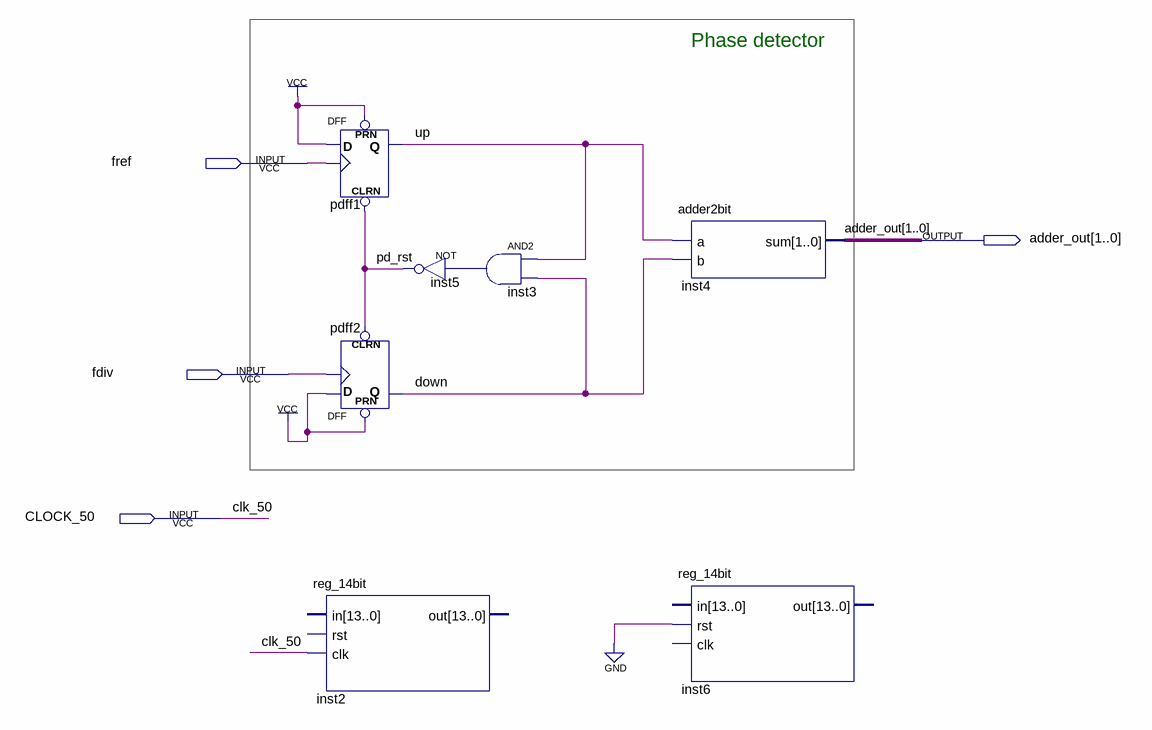
[diagram p0: schematic sheet]
// Quartus schematic Digital_async_PLL.bdf as structural Verilog: 7 symbols, 4 pins
module Digital_async_PLL (
  input  fref,
  input  fdiv,
  input  CLOCK_50,
  output [1:0] adder_out
);

  wire down, inst3_out, pd_rst, up;

  DFF pdff1 (.CLRN(pd_rst), .CLK(fref), .D(1'b1), .PRN(1'b1), .Q(up));
  DFF pdff2 (.CLRN(pd_rst), .CLK(fdiv), .D(1'b1), .PRN(1'b1), .Q(down));
  reg_14bit inst2 (.clk(CLOCK_50));  // open: in, rst, out
  not inst5 (pd_rst, inst3_out);
  and inst3 (inst3_out, up, down);
  adder2bit inst4 (.a(up), .b(down), .sum(adder_out));
  reg_14bit inst6 (.rst(1'b0));  // open: in, clk, out

  // Other names for the same wires on the sheet: clk_50 = CLOCK_50

  // Notes on the sheet:
  //   Phase detector
endmodule
